# Altium schematic sheet CH32V307VCT6-R1.SchDoc
size 457 x 287 mm; SheetNumber: 0; SheetTotal: 0
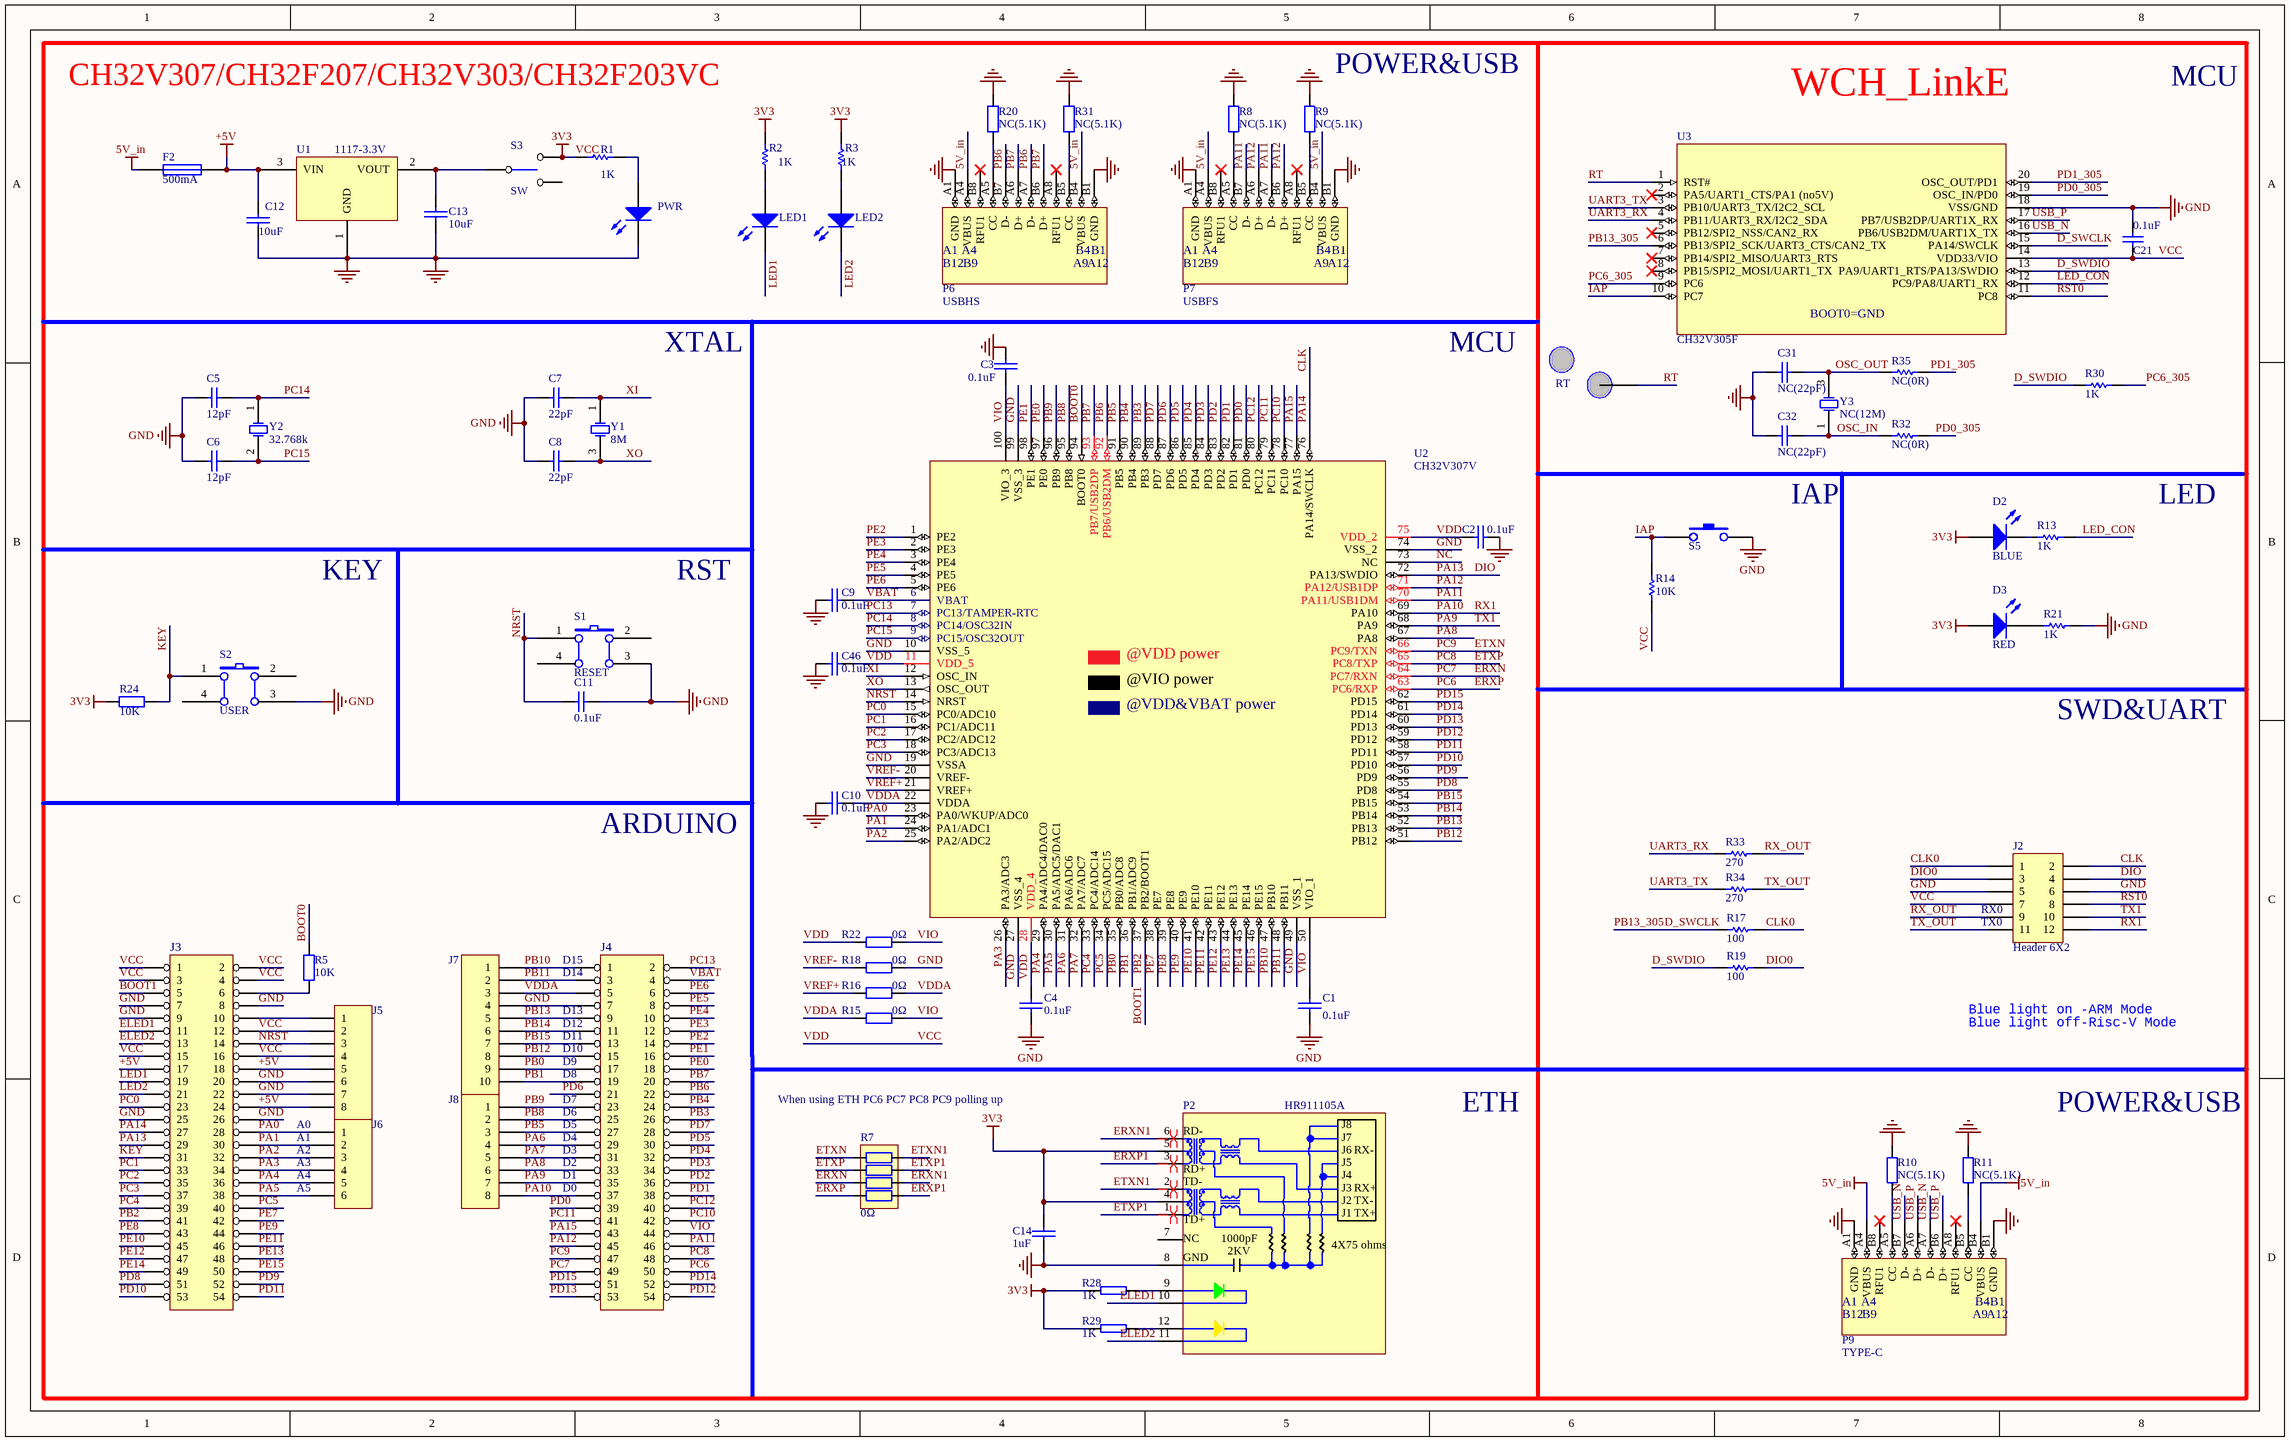
[diagram p0: CH32V307VCT6-R1.SchDoc]

## Parts
C1  0.1uF  [0603_C]
C2  0.1uF  [0603_C]
C3  0.1uF  [0603_C]
C4  0.1uF  [0603_C]
C5  12pF  [0603_C]
C6  12pF  [0603_C]
C7  22pF  [0603_C]
C8  22pF  [0603_C]
C9  0.1uF  [0603_C]
C10  0.1uF  [0603_C]
C11  0.1uF  [0603_C]
C12  10uF  [3216_C]
C13  10uF  [3216_C]
C14  1uF  [0603_C]
C21  0.1uF  [0603_C]
C31  NC(22pF)  [0603_C]
C32  NC(22pF)  [0603_C]
C46  0.1uF  [0603_C]
D2  BLUE  [0603+]
D3  RED  [0603+]
F2  500mA  [0805]
J2  Header 6X2  [IDC12-2.54mm]
J3  HEADER 27x2  [IDC54-2.54MM]  (value not drawn)
J4  HEADER 27x2  [IDC54-2.54MM]  (value not drawn)
J5  Header 8  [SIP8-2.54mm]  (value not drawn)
J6  Header 6  [SIP6-2.54MM]  (value not drawn)
J7  Header 10  [SIP10-2.54mm]  (value not drawn)
J8  Header 8  [SIP8-2.54mm]  (value not drawn)
LED1  LED1   blue  [0603+]  (value not drawn)
LED2  LED2  blue  [0603+]  (value not drawn)
P2  HR911105A  [HR911105A]
P6  USBHS  [TYPE-C-Receptacle-2.0]
P7  USBFS  [TYPE-C-Receptacle-2.0]
P9  TYPE-C  [TYPE-C-Receptacle-2.0]
PWR  POWER  red  [0603+]  (value not drawn)
R1  1K  [0603]
R2  1K  [0603]
R3  1K  [0603]
R5  10K  [0603]
R7  0Ω  [RCA-8P4R-0603]
R8  NC(5.1K)  [0603]
R9  NC(5.1K)  [0603]
R10  NC(5.1K)  [0603]
R11  NC(5.1K)  [0603]
R13  1K  [0603]
R14  10K  [0603]
R15  0Ω  [0603]
R16  0Ω  [0603]
R17  100  [0603]
R18  0Ω  [0603]
R19  100  [0603]
R20  NC(5.1K)  [0603]
R21  1K  [0603]
R22  0Ω  [0603]
R24  10K  [0603]
R28  1K  [0603]
R29  1K  [0603]
R30  1K  [0603]
R31  NC(5.1K)  [0603]
R32  NC(0R)  [0603]
R33  270  [0603]
R34  270  [0603]
R35  NC(0R)  [0603]
RT  Testpoint  [TESTPOINT1]  (value not drawn)
S1  RESET  [KEYX]
S2  USER  [KEYX]
S3  SW  [SW1]
S5  KEY  [贴片按键]  (value not drawn)
U1  1117-3.3V  [SOT-223]
U2  CH32V307V  [LQFP100]
U3  CH32V305F  [TSSOP20]
Y1  8M  [XT3225]
Y2  32.768k  [FC-135]
Y3  NC(12M)  [XT3225]

## Nets
5V_in: F2.1 P6.A4(VBUS) P6.B4(VBUS) P7.A4(VBUS) P7.B4(VBUS) P9.A4(VBUS) P9.B4(VBUS)
+5V: C12.1 F2.2 J3.17 J3.18 J3.24 J5.5 J5.8 U1.3(VIN)
GND: C1.1 C2.1 C3.2 C4.1 C5.2 C6.2 C7.1 C8.1 C9.1 C10.1 C11.1 C12.2 C13.2 C14.1 C21.2 C31.1 C32.1 C46.2 J2.5 J2.6 J3.7 J3.8 J3.9 J3.20 J3.22 J3.25 J3.26 J4.7 J5.6 J5.7 J7.4 P2.8 P6.A1(GND) P6.B1(GND) P7.A1(GND) P7.B1(GND) P9.A1(GND) P9.B1(GND) PWR.2(K) R8.1 R9.1 R10.2 R11.2 R18.1 R20.1 R21.1 R31.1 S1.3(B1) S2.3(B1) S5.2 U1.1(GND) U2.10(VSS_5) U2.19(VSSA) U2.27(VSS_4) U2.49(VSS_1) U2.74(VSS_2) U2.99(VSS_3) U3.18(VSS/GND)
VCC: C2.2 C4.2 C14.2 C21.1 C46.1 D2.1(A) D3.1(A) J2.7 J3.1 J3.2 J3.3 J3.4 J3.12 J3.15 J3.16 J5.2 J5.4 P2.4 P2.5 R1.2 R2.1 R3.1 R14.2 R22.2 R24.2 R28.1 R29.1 S3.3 U2.11(VDD_5) U2.28(VDD_4) U2.75(VDD_2) U3.14(VDD33/VIO)  [also labelled 3V3, VDD]
BOOT0: R5.2 U2.94(BOOT0)
BOOT1: J3.5 J3.41 U2.37(PB2/BOOT1)  [also labelled PB2]
CLK: J2.2 J3.27 U2.76(PA14/SWCLK)  [also labelled PA14]
CLK0: J2.1 R17.1
D_SWCLK: R17.2 U3.6(PB13/SPI2_SCK/UART3_CTS/CAN2_TX) U3.15(PA14/SWCLK)  [also labelled PB13_305]
D_SWDIO: R19.2 R30.1 U3.13(PA9/UART1_RTS/PA13/SWDIO)
DIO: J2.4 J3.29 U2.72(PA13/SWDIO)  [also labelled PA13]
DIO0: J2.3 R19.1
ELED1: J3.11 P2.10
ELED2: J3.13 P2.11
ERXN: J4.49 R7.3 U2.64(PC7/RXN)  [also labelled PC7]
ERXN1: P2.6 R7.6
ERXP: J4.50 R7.4 U2.63(PC6/RXP)  [also labelled PC6]
ERXP1: P2.3 R7.5
ETXN: J4.47 R7.1 U2.66(PC9/TXN)  [also labelled PC9]
ETXN1: P2.2 R7.8
ETXP: J4.48 R7.2 U2.65(PC8/TXP)  [also labelled PC8]
ETXP1: P2.1 R7.7
IAP: R14.1 S5.1 U3.10(PC7)
KEY: J3.31 R24.1 S2.1(A0)
LED1: J3.19 LED1.2(K)
LED2: J3.21 LED2.2(K)
LED_CON: R13.1 U3.12(PC9/PA8/UART1_RX)
NC: U2.73(NC)
NRST: C11.2 J3.14 J5.3 S1.1(A0) U2.14(NRST)
OSC_IN: C32.2 R32.2 Y3.1(OSC1)
OSC_OUT: C31.2 R35.2 Y3.3(OSC2)
PA0: J3.28 J6.1 U2.23(PA0/WKUP/ADC0)
PA1: J3.30 J6.2 U2.24(PA1/ADC1)
PA2: J3.32 J6.3 U2.25(PA2/ADC2)
PA3: J3.34 J6.4 U2.26(PA3/ADC3)
PA4: J3.36 J6.5 U2.29(PA4/ADC4/DAC0)
PA5: J3.38 J6.6 U2.30(PA5/ADC5/DAC1)
PA6: J4.29 J8.4 U2.31(PA6/ADC6)
PA7: J4.31 J8.5 U2.32(PA7/ADC7)
PA8: J4.33 J8.6 U2.67(PA8)
PA9: J2.10 J4.35 J8.7 U2.68(PA9)  [also labelled TX1]
PA10: J2.12 J4.37 J8.8 U2.69(PA10)  [also labelled RX1]
PA11: J4.46 P7.A7(D-) P7.B7(D-) U2.70(PA11/USB1DM)
PA12: J4.45 P7.A6(D+) P7.B6(D+) U2.71(PA12/USB1DP)
PA15: J4.43 U2.77(PA15)
PB0: J4.17 J7.9 U2.35(PB0/ADC8)
PB1: J4.19 J7.10 U2.36(PB1/ADC9)
PB3: J4.26 U2.89(PB3)
PB4: J4.24 U2.90(PB4)
PB5: J4.27 J8.3 U2.91(PB5)
PB6: J4.22 P6.A7(D-) P6.B7(D-) U2.92(PB6/USB2DM)
PB7: J4.20 P6.A6(D+) P6.B6(D+) U2.93(PB7/USB2DP)
PB8: J4.25 J8.2 U2.95(PB8)
PB9: J4.23 J8.1 U2.96(PB9)
PB10: J4.1 J7.1 U2.47(PB10)
PB11: J4.3 J7.2 U2.48(PB11)
PB12: J4.15 J7.8 U2.51(PB12)
PB13: J4.9 J7.5 U2.52(PB13)
PB14: J4.11 J7.6 U2.53(PB14)
PB15: J4.13 J7.7 U2.54(PB15)
PC0: J3.23 U2.15(PC0/ADC10)
PC1: J3.33 U2.16(PC1/ADC11)
PC2: J3.35 U2.17(PC2/ADC12)
PC3: J3.37 U2.18(PC3/ADC13)
PC4: J3.39 U2.33(PC4/ADC14)
PC5: J3.40 U2.34(PC5/ADC15)
PC6_305: R30.2 U3.9(PC6)
PC10: J4.42 U2.78(PC10)
PC11: J4.41 U2.79(PC11)
PC12: J4.40 U2.80(PC12)
PC13: J4.2 U2.7(PC13/TAMPER-RTC)
PC14: C5.1 U2.8(PC14/OSC32IN) Y2.1(OSC1)
PC15: C6.1 U2.9(PC15/OSC32OUT) Y2.2(OSC2)
PD0: J4.39 U2.81(PD0)
PD0_305: R32.1 U3.19(OSC_IN/PD0)
PD1: J4.38 U2.82(PD1)
PD1_305: R35.1 U3.20(OSC_OUT/PD1)
PD2: J4.36 U2.83(PD2)
PD3: J4.34 U2.84(PD3)
PD4: J4.32 U2.85(PD4)
PD5: J4.30 U2.86(PD5)
PD6: J4.21 U2.87(PD6)
PD7: J4.28 U2.88(PD7)
PD8: J3.51 U2.55(PD8)
PD9: J3.52 U2.56(PD9)
PD10: J3.53 U2.57(PD10)
PD11: J3.54 U2.58(PD11)
PD12: J4.54 U2.59(PD12)
PD13: J4.53 U2.60(PD13)
PD14: J4.52 U2.61(PD14)
PD15: J4.51 U2.62(PD15)
PE0: J4.18 U2.97(PE0)
PE1: J4.16 U2.98(PE1)
PE2: J4.14 U2.1(PE2)
PE3: J4.12 U2.2(PE3)
PE4: J4.10 U2.3(PE4)
PE5: J4.8 U2.4(PE5)
PE6: J4.6 U2.5(PE6)
PE7: J3.42 U2.38(PE7)
PE8: J3.43 U2.39(PE8)
PE9: J3.44 U2.40(PE9)
PE10: J3.45 U2.41(PE10)
PE11: J3.46 U2.42(PE11)
PE12: J3.47 U2.43(PE12)
PE13: J3.48 U2.44(PE13)
PE14: J3.49 U2.45(PE14)
PE15: J3.50 U2.46(PE15)
RST0: J2.8 U3.11(PC8)
RT: RT.1(point) U3.1(RST#)
RX_OUT: J2.9 R33.1
TX_OUT: J2.11 R34.1
UART3_RX: R33.2 U3.4(PB11/UART3_RX/I2C2_SDA)
UART3_TX: R34.2 U3.3(PB10/UART3_TX/I2C2_SCL)
USB_N: P9.A7(D-) P9.B7(D-) U3.16(PB6/USB2DM/UART1X_TX)
USB_P: P9.A6(D+) P9.B6(D+) U3.17(PB7/USB2DP/UART1X_RX)
VBAT: C9.2 J4.4 U2.6(VBAT)
VDDA: C10.2 J4.5 J7.3 R15.2 R16.1 U2.22(VDDA)
VIO: C1.2 C3.1 J4.44 R15.1 R22.1 U2.50(VIO_1) U2.100(VIO_3)
VREF+: R16.2 U2.21(VREF+)
VREF-: R18.2 U2.20(VREF-)
XI: C7.2 U2.12(OSC_IN) Y1.1(OSC1)
XO: C8.2 U2.13(OSC_OUT) Y1.3(OSC2)
NetC13_1: C13.1 S3.1 U1.2(VOUT)
NetD2_2: D2.2(K) R13.2
NetD3_2: D3.2(K) R21.2
NetJ3_6: J3.6 R5.1
NetJ3_10: J3.10 J5.1
NetLED1_1: LED1.1(A) R2.2
NetLED2_1: LED2.1(A) R3.2
NetP2_9: P2.9 R28.2
NetP2_12: P2.12 R29.2
NetP6_A5: P6.A5(CC) R20.2
NetP6_B5: P6.B5(CC) R31.2
NetP7_A5: P7.A5(CC) R8.2
NetP7_B5: P7.B5(CC) R9.2
NetP9_A5: P9.A5(CC) R10.1
NetP9_B5: P9.B5(CC) R11.1
NetPWR_1: PWR.1(A) R1.1

Not connected (* = marked no-connect by the designer): P2 7; P6 A8(RFU1)* B8(RFU1)*; P7 A8(RFU1)* B8(RFU1)*; P9 A8(RFU1)* B8(RFU1)*; S1 2(B0) 4(A1); S2 2(B0) 4(A1); S3 2; U3 2(PA5/UART1_CTS/PA1_(no5V))* 5(PB12/SPI2_NSS/CAN2_RX)* 7(PB14/SPI2_MISO/UART3_RTS)* 8(PB15/SPI2_MOSI/UART1_TX)*

## Layout directives
differential pair: ERXN1, ERXP1, ETXN1, ETXP1

## Notes on the sheet
- CH32V307/CH32F207/CH32V303/CH32F203VC
- (near R9) POWER&USB
- WCH_LinkE
- MCU
- XTAL
- IAP
- LED
- KEY
- RST
- SWD&UART
- ARDUINO
- (near J2) RX0
- (near J2) TX0
- (near J4) D13
- (near J4) D14
- (near J4) D15
- Blue light on -ARM Mode
- (near J4) D8
- (near J4) D9
- (near J4) D10
- (near J4) D11
- (near J4) D12
- Blue light off-Risc-V Mode
- A0
- A1
- (near J4) D4
- (near J4) D5
- (near J4) D6
- (near J4) D7
- When using ETH PC6 PC7 PC8 PC9 polling up
- ETH
- POWER&USB
- (near J6) A2
- (near J6) A3
- (near J6) A4
- (near J6) A5
- (near J4) D0
- (near J4) D1
- (near J4) D2
- (near J4) D3
- Title
- Size:
- Date:
- Number:
- Time:
- Revision:
- Sheet
- of
- File:
- (in symbol CH32V305F) BOOT0=GND
- (in symbol CH32V307V) @VDD power; @VIO power; @VDD&VBAT power
- (in symbol HR911105A) J8; RD-; J7; J6; RX-; J5; RD+; J4; TD-; J3; RX+; J2; TX-; J1; TX+; TD+; NC; 1000pF; 4X75 ohms; 2KV; GND
- (in symbol TYPE-C1) B12; B9; A9; A12

## Library data of the parts
C1-C4 C9 C10 C12-C14 C46 = CAP: Capacitor
C5-C8 C11 C21 C31 C32 = Cap: Capacitor
  C31 C32: Published: 8-Jun-2000; LatestRevisionDate: 17-Jul-2002; LatestRevisionNote: Re-released for DXP Platform.; PackageReference: RAD-0.3; Publisher: Altium Limited
D2 D3 = D0603: Typical RED, GREEN, YELLOW, AMBER GaAs LED; Published: 8-Jun-2000; LatestRevisionDate: 17-Jul-2002; LatestRevisionNote: Re-released for DXP Platform.; PackageVersion: Feb-2002; PackageReference: 3.2X1.6X1.1; Publisher: Altium Limited; PackageDescription: SM LED; 2 Flat Leads
F2 = FUSE1: Fuse
J2 = Header 6X2: Header, 6-Pin, Dual row; LatestRevisionDate: 17-Jul-2002; LatestRevisionNote: Re-released for DXP Platform.; Publisher: Altium Limited
J3 J4 = HEADER 27x2: Header, 27-Pin, Dual row
J5 J8 = Header 8: Header, 8-Pin; LatestRevisionDate: 17-Jul-2002; LatestRevisionNote: Re-released for DXP Platform.; Publisher: Altium Limited
J6 = Header 6: Header, 6-Pin; LatestRevisionDate: 17-Jul-2002; LatestRevisionNote: Re-released for DXP Platform.; Publisher: Altium Limited
J7 = Header 10: Header, 10-Pin; LatestRevisionDate: 17-Jul-2002; LatestRevisionNote: Re-released for DXP Platform.; Publisher: Altium Limited
LED1 LED2 PWR = LED0: Typical INFRARED GaAs LED; Published: 8-Jun-2000; LatestRevisionDate: 08-Jul-2005; LatestRevisionNote: Mech Layer 1 removed.; PackageReference: LED-0; Publisher: Altium Limited
P6 P7 P9 = TYPE-C1
R1-R3 = Res Semi: Semiconductor Resistor
R5 R8-R11 R15 R16 R18 R20 R22 R24 R31 = Res2: Resistor
R7 = R-8P4R: 贴片网络排阻; 版权归属: 源创客; BOM名称: 贴片网络排阻; 学习资源: www.ooocke.com
R13 R14 R17 R19 R21 R30 R32-R35 = R0603: Resistor; Published: 8-Jun-2000; LatestRevisionDate: 17-Jul-2002; LatestRevisionNote: Re-released for DXP Platform.; PackageReference: AXIAL-0.3; Publisher: Altium Limited; PackageDescription: Axial Device, Thru-Hole; 2 Leads; 0.3 in Pin Spacing
R28 R29 = RES
RT = Testpoint: 测试点
S1 S2 = SW PUSHBUTTON: SE PUSHBUTTON
U2 = CH32V307V: RISC-V FPU HD-MCU, 144MHz, USB_480M, USB OTG, 1000M Ethernet MAC, 2*CAN, FSMC+DVP
U3 = CH32V305F: RISC-V FPU HD-MCU, 144MHz, USB_480M, CAN, UART*2, SPI
Y1-Y3 = XTAL: Crystal Oscillator
  Y1 Y2: Published: 8-Jun-2000; LatestRevisionDate: 17-Jul-2002; LatestRevisionNote: Re-released for DXP Platform.; PackageReference: R38; Publisher: Altium Limited